# Altium project CTR-Lower-Main-Board-Rev-C.PrjPcb (part 4 of 4)

## Sheet ID3.SchDoc: ZoZbot Lower Main Board - ID3
size B; Author: RMG; Organization: OLogic, Inc.; DocumentNumber: LMB9; Revision: C; SheetNumber: 9; SheetTotal: 10; PageSetup: Record=PageOptions|CenterHorizontal=True|CenterVertical=True|PrintScale=0.70|XCorrection=1.00|YCorrection=1.00|PrintKind=0|BorderSize=5000000|LeftOffset=0|BottomOffset=0|Orientation=2|PaperLength=1000|PaperWidth=1000|Scale=100|PaperSource=15|PrintQuality=600|MediaType=1|DitherType=10|PrintScaleMode=1|PaperKind=Letter|PaperIndex=1
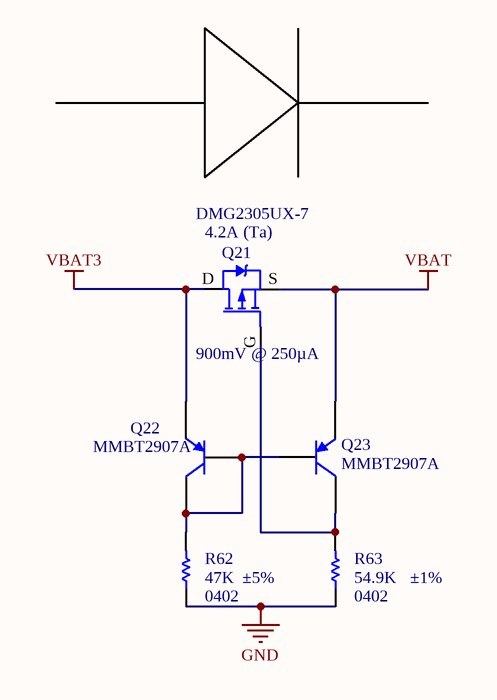
[diagram p9: ID3.SchDoc]

### Parts
Q21  Current - Continuous Drain (Id) @ 25°C: 4.2A (Ta)  Vgs(th) (Max) @ Id: 900mV @ 250µA  [DMG2305UX-7]  (hidden comment: DMG2305UX)
Q22  MMBT2907A  [SOT23]
Q23  MMBT2907A  [SOT23]
R62  47K  Tolerance: ±5%  Supplier Device Package: 0402  [RESC0402(1005)_N]
R63  54.9K  Tolerance: ±1%  Supplier Device Package: 0402  [RESC0402(1005)_N]

### Nets
GND: R62.1 R63.1
VBAT: Q21.S Q23.2(E)
VBAT3: Q21.D Q22.2(E)
NetQ21_G: Q21.G Q23.3(C) R63.2
NetQ22_1: Q22.1(B) Q22.3(C) Q23.1(B) R62.2

### Notes on the sheet
- Title
- By:
- Date:
- Number:
- Time:
- Revision:
- Sheet
- of
- OLogic, Inc.
- 1394 Borregas Ave.
- Sunnyvale, CA
- 94089 USA
- File:
- (650) 996-1490

### Library data of the parts
Q21 = DMG2305UX: MOSFET P-CH 20V 4.2A SOT23; Manufacturer: Diodes Incorporated; FET Type: MOSFET P-Channel, Metal Oxide; FET Feature: Standard; Rds On (Max) @ Id, Vgs: 52 mOhm @ 4.2A, 4.5V; Gate Charge (Qg) @ Vgs: 10.2nC @ 4.5V; Input Capacitance (Ciss) @ Vds: 808pF @ 15V; Power - Max: 1.4W; Supplier 1: Digi-Key; RoHS: RoHS Compliant; Category: Discrete Semiconductor Products; Stock 1: 78669; Pricing 1: 1=0.38, 10=0.311, 100=0.1649, 500=0.10846, 1000=0.0739 (USD); Packaging: Cut Tape (CT); Drain to Source Voltage (Vdss): 20V; Operating Temperature: -55°C ~ 150°C (TJ); Mounting Type: Surface Mount; Package / Case: TO-236-3, SC-59, SOT-23-3; Supplier Device Package: SOT-23; ComponentLink1URL: http://www.diodes.com/_files/datasheets/DMG2305UX.pdf; ComponentLink1Description: http://www.diodes.com/_files/datasheets/DMG2305UX.pdf; Supplier Part Number 1: DMG2305UX-7DICT-ND; Creator: osman; Manufacturer Part Number: DMG2305UX-7
Q22 Q23 = MMBT2907A: PNP General Purpose Amplifier; Manufacturer: Fairchild Semiconductor; Vendor: Digikey; PN: MMBT2907AFSCT-ND; Current - Collector (Ic) (Max): 800mA; Voltage - Collector Emitter Breakdown (Max): 60V; Vce Saturation (Max) @ Ib, Ic: 1.6V @ 50mA, 500mA; DC Current Gain (hFE) (Min) @ Ic, Vce: 100 @ 150mA, 10V; Power - Max: 350mW; Frequency - Transition: 200MHz; MPN: MMBT2907A; Supplier 1: Digi-Key; Manufacturer Part Number: MMBT2907A; RoHS: RoHS Compliant; Category: Discrete Semiconductor Products; Stock 1: 74892; Pricing 1: 1=0.2, 10=0.187, 25=0.17, 100=0.1224, 250=0.07208, 500=0.0598, 1000=0.04079 (USD); Packaging: Cut Tape (CT); Transistor Type: PNP; Current - Collector Cutoff (Max): -; Mounting Type: Surface Mount; Package / Case: TO-236-3, SC-59, SOT-23-3; Supplier Device Package: SOT-23; ComponentLink1URL: http://www.fairchildsemi.com/ds/MM/MMBT2907A.pdf; ComponentLink1Description: http://www.fairchildsemi.com/ds/MM/MMBT2907A.pdf; Supplier Part Number 1: MMBT2907AFSCT-ND
R62 = RES 47K OHM 5% 1/10W 0402: 47K 0402; Manufacturer: Panasonic Electronic Components; Manufacturer Part Number: ERJ-2GEJ473X; Power (Watts): 0.1W, 1/10W; Temperature Coefficient: ±200ppm/°C; Supplier 1: Digi-Key; RoHS: RoHS Compliant; Category: Resistors; Stock 1: 1670564; Pricing 1: 1=0.1, 50=0.0106, 100=0.0078, 250=0.00596, 500=0.00476, 1000=0.0035, 5000=0.00251 (USD); Packaging: Cut Tape (CT); Resistance (Ohms): 47k; Composition: Thick Film; Features: Automotive AEC-Q200; Operating Temperature: -55°C ~ 155°C; Package / Case: 0402 (1005 Metric); Size / Dimension: 0.039" L x 0.020" W (1.00mm x 0.50mm); Height: 0.016" (0.40mm); Number of Terminations: 2; ComponentLink1URL: http://industrial.panasonic.com/www-cgi/jvcr13pz.cgi?E+PZ+3+AOA0001+ERJ2GEJ473X+7+WW; ComponentLink1Description: http://industrial.panasonic.com/www-cgi/jvcr13pz.cgi?E+PZ+3+AOA0001+ERJ2GEJ473X+7+WW; Supplier Part Number 1: P47KJCT-ND
R63 = RES 54.9K OHM 1% 1/10W 0402: 54.9K 1% 0402; Manufacturer: Panasonic Electronic Components; Manufacturer Part Number: ERJ-2RKF5492X; Power (Watts): 0.1W, 1/10W; Temperature Coefficient: ±100ppm/°C; Supplier 1: Digi-Key; RoHS: RoHS Compliant; Category: Resistors; Stock 1: 151111; Pricing 1: 1=0.1, 50=0.015, 100=0.011, 250=0.0084, 500=0.00674, 1000=0.00496, 5000=0.00355 (USD); Packaging: Cut Tape (CT); Part Status: Active; Resistance (Ohms): 54.9k; Composition: Thick Film; Features: Automotive AEC-Q200; Operating Temperature: -55°C ~ 155°C; Package / Case: 0402 (1005 Metric); Size / Dimension: 0.039" L x 0.020" W (1.00mm x 0.50mm); Height - Seated (Max): 0.016" (0.40mm); Number of Terminations: 2; Failure Rate: -; ComponentLink1URL: http://industrial.panasonic.com/www-cgi/jvcr13pz.cgi?E+PZ+3+AOA0002+ERJ2RKF5492X+7+WW; ComponentLink1Description: http://industrial.panasonic.com/www-cgi/jvcr13pz.cgi?E+PZ+3+AOA0002+ERJ2RKF5492X+7+WW; Supplier Part Number 1: P54.9KLCT-ND

## Nets that join several sheets
3.3V: CTR-Lower-Main-Board-Rev-C-BTLE (17 pins), CTR-Lower-Main-Board-Rev-C-Power (3.3V_TP.1 C31.1 U8.5)
5V: CTR-Lower-Main-Board-Rev-C-BTLE (5 pins), CTR-Lower-Main-Board-Rev-C-LED (6 pins), CTR-Lower-Main-Board-Rev-C-Power (6 pins), ID5 (Q28.S Q30.2)
5V_REG: CTR-Lower-Main-Board-Rev-C-Power (6 pins), ID5 (Q28.D Q29.2)
GND: CTR-Lower-Main-Board-Rev-C-BTLE (32 pins), CTR-Lower-Main-Board-Rev-C-LED (9 pins), CTR-Lower-Main-Board-Rev-C-Motor (48 pins), ID4 (R64.1 R65.1), CTR-Lower-Main-Board-Rev-C-Power (40 pins), ID5 (R66.1 R67.1), ID1 (R58.1 R59.1), ID2 (R60.1 R61.1), ID3 (R62.1 R63.1)
VBAT: CTR-Lower-Main-Board-Rev-C-Power (5 pins), ID1 (Q3.S Q8.2), ID2 (Q18.S Q20.2), ID3 (Q21.S Q23.2)
VBAT1: CTR-Lower-Main-Board-Rev-C-Power (BAT1.2 R11.2 U5.3 VBAT1_TP.1), ID1 (Q3.D Q4.2)
VBAT2: CTR-Lower-Main-Board-Rev-C-Power (BAT2.2 R9.2 U6.3 VBAT2_TP.1), ID2 (Q18.D Q19.2)
VBAT3: CTR-Lower-Main-Board-Rev-C-Power (BAT3.2 R10.2 U7.3 VBAT3_TP.1), ID3 (Q21.D Q22.2)
VMOTOR: CTR-Lower-Main-Board-Rev-C-Motor (16 pins), ID4 (Q24.S Q26.2)
VSW: CTR-Lower-Main-Board-Rev-C-Motor (R88.2), ID4 (Q24.D Q25.2), CTR-Lower-Main-Board-Rev-C-Power (9 pins)
BAT1_STATUS: CTR-Lower-Main-Board-Rev-C-BTLE (R19.2), CTR-Lower-Main-Board-Rev-C-Power (R2.2 U5.1)
BAT2_STATUS: CTR-Lower-Main-Board-Rev-C-BTLE (R23.2), CTR-Lower-Main-Board-Rev-C-Power (R6.2 U6.1)
BAT3_STATUS: CTR-Lower-Main-Board-Rev-C-BTLE (R29.2), CTR-Lower-Main-Board-Rev-C-Power (R12.2 U7.1)
BAT_MON1: CTR-Lower-Main-Board-Rev-C-BTLE (U1.12), CTR-Lower-Main-Board-Rev-C-Power (C27.1 R11.1 R15.1)
BAT_MON2: CTR-Lower-Main-Board-Rev-C-BTLE (U1.11), CTR-Lower-Main-Board-Rev-C-Power (C25.1 R9.1 R13.1)
BAT_MON3: CTR-Lower-Main-Board-Rev-C-BTLE (U1.22), CTR-Lower-Main-Board-Rev-C-Power (C26.1 R10.1 R14.1)
I2C_SCL: CTR-Lower-Main-Board-Rev-C-BTLE (Q32.3 R71.1 Upper_Main_Board.4), CTR-Lower-Main-Board-Rev-C-Power (I2C_SCL.1)
I2C_SDA: CTR-Lower-Main-Board-Rev-C-BTLE (Q31.3 R69.1 Upper_Main_Board.5), CTR-Lower-Main-Board-Rev-C-Power (I2C_SDA.1)
LED_BANK_A: CTR-Lower-Main-Board-Rev-C-BTLE (U1.23), CTR-Lower-Main-Board-Rev-C-LED (Q14.1 R38.2)
LED_BANK_B: CTR-Lower-Main-Board-Rev-C-BTLE (U1.42), CTR-Lower-Main-Board-Rev-C-LED (Q13.1 R37.2)
LED_BANK_C: CTR-Lower-Main-Board-Rev-C-BTLE (U1.27), CTR-Lower-Main-Board-Rev-C-LED (Q12.1 R36.2)
LED_PWM_BLUE: CTR-Lower-Main-Board-Rev-C-BTLE (U1.18), CTR-Lower-Main-Board-Rev-C-LED (Q16.1)
LED_PWM_GREEN: CTR-Lower-Main-Board-Rev-C-BTLE (U1.19), CTR-Lower-Main-Board-Rev-C-LED (Q15.1)
LED_PWM_RED: CTR-Lower-Main-Board-Rev-C-BTLE (U1.20), CTR-Lower-Main-Board-Rev-C-LED (Q17.1)
M1_PWMA: CTR-Lower-Main-Board-Rev-C-BTLE (U1.28), CTR-Lower-Main-Board-Rev-C-Motor (U2.2)
M1_PWMB: CTR-Lower-Main-Board-Rev-C-BTLE (U1.29), CTR-Lower-Main-Board-Rev-C-Motor (U2.3)
M2_PWMA: CTR-Lower-Main-Board-Rev-C-BTLE (U1.14), CTR-Lower-Main-Board-Rev-C-Motor (U3.2)
M2_PWMB: CTR-Lower-Main-Board-Rev-C-BTLE (U1.15), CTR-Lower-Main-Board-Rev-C-Motor (U3.3)
M3_PWMA: CTR-Lower-Main-Board-Rev-C-BTLE (U1.17), CTR-Lower-Main-Board-Rev-C-Motor (U4.2)
M3_PWMB: CTR-Lower-Main-Board-Rev-C-BTLE (U1.16), CTR-Lower-Main-Board-Rev-C-Motor (U4.3)
POWER_OFF: CTR-Lower-Main-Board-Rev-C-BTLE (U1.43), CTR-Lower-Main-Board-Rev-C-Power (D5.1)
VCHRG_OFF: CTR-Lower-Main-Board-Rev-C-BTLE (U1.21), CTR-Lower-Main-Board-Rev-C-Power (C33.1 Q2.G Q7.1 R22.1)

## Assembly variants
6V Motor Power: not fitted CN1 Q24 Q25 Q26 R64 R65 R87 R89 R90 UART
VSW Motor Power: not fitted C18 C24 C34 C35 C42 C44 C45 C46 C47 C48 C49 C50 CN1 D1 D2 D3 L5 L6 L7 R72 R73 R74 R75 R76 R77 R78 R79 R80 R81 R82 R83 R84 R85 R86 R88 U10 U11 U12 UART